# Altium schematic sheet Sheet1.SchDoc
size A4; SheetNumber: 1; SheetTotal: 1
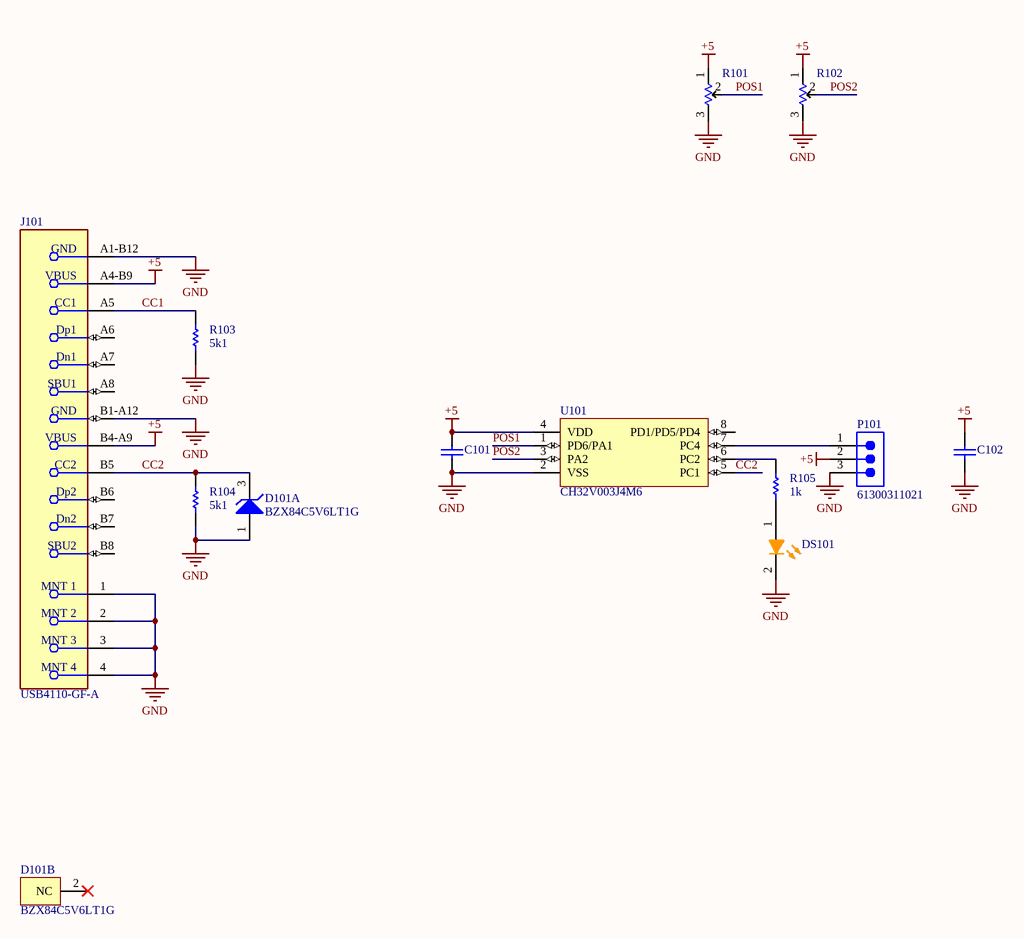
[diagram p0: Sheet1.SchDoc]

## Parts
C101  Capacitor  [CAPC1608X09N]  (value not drawn)
C102  Capacitor  [CAPC1608X09N]  (value not drawn)
D101  BZX84C5V6LT1G  [ONSC-SOT-23-3-318-08_V]  (parts A,B of 2)
DS101  KP-1608SECK  [KING-0603LED_ORANGE_V]  (value not drawn)
J101  USB4110-GF-A  [FP-USB4110-GF-A-MFG]
P101  61300311021  [61300311021]
R101  Cermet Trimmer  [CERMET_TRIMMER_SMD]  (value not drawn)
R102  Cermet Trimmer  [CERMET_TRIMMER_SMD]  (value not drawn)
R103  5k1  [RESC1608X06N]
R104  5k1  [RESC1608X06N]
R105  1k  [RESC1608X06N]
U101  CH32V003J4M6  [SOIC127P600X155-8N]

## Nets
+5: C101.2 C102.2 J101.A4-B9(VBUS) J101.B4-A9(VBUS) P101.2 R101.1(CCW) R102.1(CCW) U101.4(VDD)
GND: C101.1 C102.1 D101.1(A) DS101.2(K) J101.1(MNT_1) J101.2(MNT_2) J101.3(MNT_3) J101.4(MNT_4) J101.A1-B12(GND) J101.B1-A12(GND) P101.3 R101.3(CW) R102.3(CW) R103.1 R104.1 U101.2(VSS)
CC1: J101.A5(CC1) R103.2
CC2: D101.3(K) J101.B5(CC2) R104.2 U101.5(PC1)
POS1: R101.2(WIPER) U101.1(PD6/PA1)
POS2: R102.2(WIPER) U101.3(PA2)
NetDS101_1: DS101.1(A) R105.1
NetP101_1: P101.1 U101.7(PC4)
NetR105_2: R105.2 U101.6(PC2)

Not connected (* = marked no-connect by the designer): D101 2(NC)*; J101 A6(Dp1) A7(Dn1) A8(SBU1) B6(Dp2) B7(Dn2) B8(SBU2); U101 8(PD1/PD5/PD4)

## Library data of the parts
C101 C102 = C0603: Value: 1p; Voltage: *; Dielectric: *
D101 = CMP-1060-00974-1: Zener Voltage Regulator, 225 mW, 3-Pin SOT-23, Pb-Free, Tape and Reel; Manufacturer: On Semiconductor; Packing: Tape and Reel; DatasheetVersion: Rev. 17; Mounting Technology: Surface Mount; ComponentLink1URL: http://www.onsemi.com/; PackageDescription: 3-Pin Small Outline Transistor, Body 2.92 x 1.3 mm, Pitch 0.95 mm; ComponentLink1Description: Manufacturer URL; ComponentLink3Description: Package Specification; ComponentLink2Description: Datasheet; PackageVersion: Rev. AP, 11/2009; PackageReference: SOT-23-3-318-08; ComponentLink2URL: http://www.onsemi.com/pub_link/Collateral/BZX84C2V4LT1-D.PDF; PartNumber: BZX84C5V6LT1G; RoHS: Pb-Free; ComponentLink3URL: http://www.onsemi.cn/pub_link/Collateral/318-08.PDF
DS101 = LED Orange: LED, SMT, 0603(1608), 1.1mm thickness, Orange; Manufacturer: Kingbright; Power Dissipation: 75 mW; Packing Type: 2000 pcs / reel; Reverse Voltage: 5 V; Forward Current: 30 mA; Storage Temperature: -40 to +85 degC; ComponentLink2Description: Datasheet; ComponentLink1URL: http://www.kingbright.com/; Mounting Technology: Surface Mount; ComponentLink2URL: http://www.kingbright.com/manager/upload/pdf/(1366274642)KP-1608SECK(Ver.14A).pdf; PackageDescription: 2-Pin SMT LED, 1.6 x 0.8 mm Pitch; PartNumber: KP-1608SECK; ComponentLink1Description: Manufacturer URL; PackageReference: 0603LED_ORANGE
J101 = CMP-245163-000002-1: CONN USB 2.0 TYPE-C R/A SMT; Manufacturer: GCT; Conn Orientation: Right Angle; Usb Standard: USB 2.0; Voltage Rating: 20V; Current Rating: 3/4.25/1.25/0.25A; Number Of Contacts: 16; Is Female: yes; Shielding: true; Standoff Height: 0.1mm; Octopart: https://octopart.com/usb4110-gf-a-gct-103941985; Temperature: -40°C to +85°C; RoHS: TRUE; Automotive: No; Contact Material: Gold,Nickel; Device Class L1: Connectors; Device Class L2: USB Connectors; Package: 0; Lead Free: Yes; ComponentLink2URL: https://gct.co/files/drawings/usb4110.pdf; Temperature Range High: +85°C; Temperature Range Low: -40°C; Height: 3.46mm; Manufacturer Part Number: USB4110-GF-A; ComponentLink2Description: Datasheet; Device Class L3: unset; Digikey Description: CONN USB 2.0 TYPE-C R/A SMT; Category: Conn
P101 = CMP-1502-01061-4: THT Angled Pin Header WR-PHD, Pitch 2.54 mm, Single Row, 3 pins; Contact Resistance: 20mΩ; Number of Positions: 3; Operating Supply Voltage: 250V; Connector Type: Male Pin; Gender: Male; Current Rating: 3A; Pitch: 2.54mm; Number of Pins: 3; Lead Pitch: 2.54mm; Mount: Through Hole; Contact Material: Copper; Contact Plating: Gold; Color: Black; Number of Contacts: 3; Packaging: Bulk; Contact Mating Length: 5.9944mm; Number of Rows: 1; Termination: Solder; RoHS: Compliant
R101 R102 = Trimmer_SMD: SMD Trimmer Resistor; Manufacturer: Bourns; Manufacturer Part Number: 3250W-1-100; Power Rating: 1W; Tolerance: 5%; Temperature Coefficient: 50ppm/°C; Height: 14.09mm; Digikey Description: TRIMMER 10 OHM 1W PC PIN TOP ADJ; Series: Trimpot 3250 - Sealed; RoHS: TRUE; Temperature: -65°C to +150°C; ComponentLink2URL: https://www.bourns.com/docs/Product-Datasheets/3250.pdf; Automotive: No; Package: 3250W; Temperature Range Low: -65°C; Mouser Description: Trimmer Resistors - Through Hole 10 OHMS 5% Square Sealed; Category: Res; Device Class L2: Resistors; Lead Free: Yes; Device Class L3: Variable Resistors and Potentiometers; Composition: Wirewound; ComponentLink2Description: Datasheet; Temperature Range High: +150°C; Octopart: https://octopart.com/3250w-1-100-bourns-973860; Device Class L1: Passive Components
R103-R105 = R0603: Resistor; Value: *
U101 = CH32V003J4M6: CH32V003 series is an industrial-grade general-purpose microcontroller designed based on QingKe RISC-V2A / core, which supports 48MHz system main frequency in the product function